# EAGLE design DUT_board (EAGLE 9.6.2)
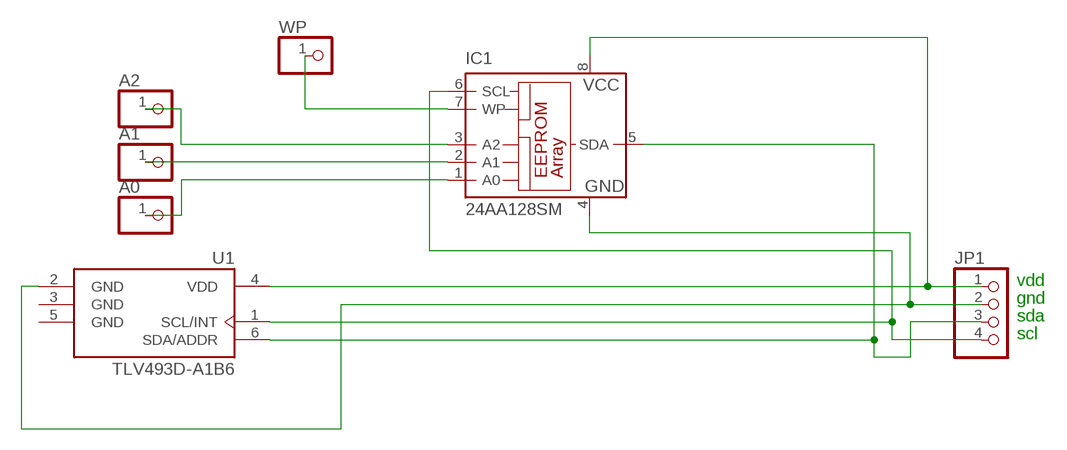
[diagram p0: schematic, sheet 1]

## Parts
A0  PINHD-1X1  [1X01]
A1  PINHD-1X1  [1X01]
A2  PINHD-1X1  [1X01]
IC1  24AA128SM  [SO-08M]
JP1  PINHD-1X4  [1X04]
U1  TLV493D-A1B6  [SOP95P250X110-6N-1-V1]
WP  PINHD-1X1  [1X01]

## Nets
N$1: IC1.8(VCC) JP1.1 U1.4(VDD)
N$2: IC1.4(GND) JP1.2 U1.2(GND)
N$3: IC1.6(SCL) JP1.4 U1.1(SCL/INT)
N$4: IC1.5(SDA) JP1.3 U1.6(SDA/ADDR)
N$5: A2.1 IC1.3(A2)
N$6: A1.1 IC1.2(A1)
N$7: A0.1 IC1.1(A0)
N$8: IC1.7(WP) WP.1

## Notes on the sheet
- vdd
- gnd
- sda
- scl

## Power pins joined to a net without a drawn wire
GND: U1.3(GND) U1.5(GND)

## Library data of the parts
A0 A1 A2 WP = pinhead:PINHD-1X1: PIN HEADER
IC1 = microchip:24*: Serial EEPROM I2C; MF: MICROCHIP; MPN: 24AA128-I/MS; OC_FARNELL: 1331285; OC_NEWARK: 92C6839
JP1 = pinhead:PINHD-1X4: PIN HEADER
U1 = TLV493D-A1B6:TLV493D-A1B6: TLV493D-A1B6 Low Power 3D Magnetic Sensor with I2C Interface SOP95P250X110-6N-1-V1

## Board
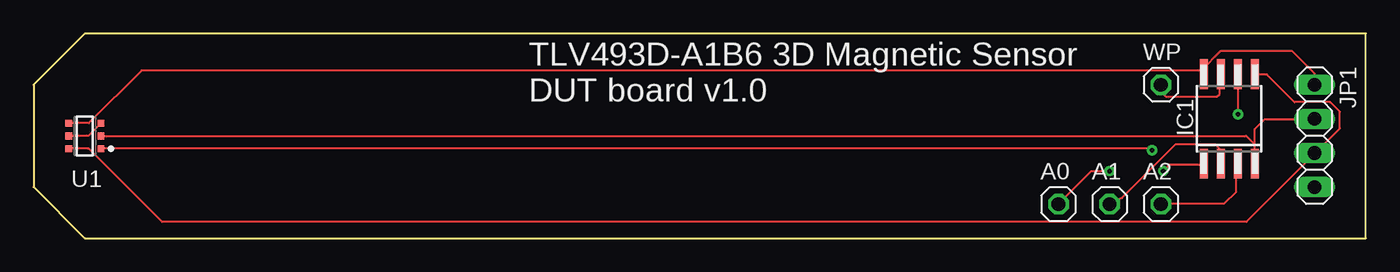
[diagram p1: board, top side]
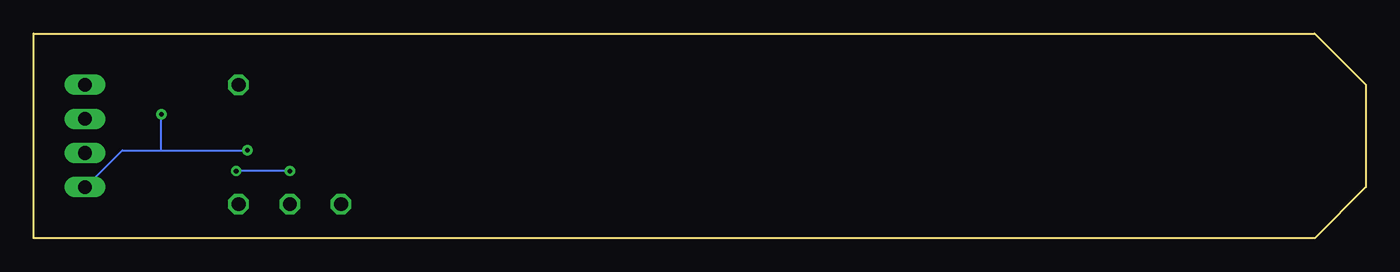
[diagram p2: board, bottom side, seen from below]

Size 99.06 x 15.24 mm. Coordinates in mm from the lower left corner, seen from the top.
Outline: 99.06,0 99.06,15.24 3.81,15.24 0,11.43 0,3.81 3.81,0 99.06,0
Copper layers (1*16): Top 0.035mm / dielectric 1.5mm / Bottom 0.035mm
Design rules "default": minimum track width 6mil, minimum drill 0.35mm, track to track 6mil, track to pad 6mil, pad to pad 6mil, via to via 6mil, smd to smd 6mil, copper to edge 40mil, drill to drill 6mil, minimum pad ring 10mil, minimum via ring 8mil, stop-mask expansion 4mil, vias tented up to drill 0mil, thermal gap 10mil

### Footprints (pad centres in the part's own frame; a part is rotated, then mirrored left to right if it is on the bottom)
1X01 = drill 1.016 octagon: 1 0,0
SO-08M = smd 0.6 x 2.2: 1 -1.905,-3.33; 2 -0.635,-3.33; 3 0.635,-3.33; 4 1.905,-3.33; 5 1.905,3.33; 6 0.635,3.33; 7 -0.635,3.33; 8 -1.905,3.33
1X04 = drill 1.016 long: 1 -3.81,0; 2 -1.27,0; 3 1.27,0; 4 3.81,0
SOP95P250X110-6N-1-V1 = smd 0.5 x 0.5: 1 -1.2,0.95; 2 -1.2,0; 3 -1.2,-0.95; 4 1.2,-0.95; 5 1.2,0; 6 1.2,0.95

### Placement (x,y rotation side)
A0  76.2,2.54 0 top
A1  80.01,2.54 0 top
A2  83.82,2.54 0 top
IC1  88.9,8.89 0 top
JP1  95.25,7.62 270 top
U1  3.81,7.62 180 top
WP  83.82,11.43 0 top

### Tracks (layer width: path | path; a pad name or v marks a point on that pad's centre or on a via)
GND
  Top 0.152: U1.5 4.06,7.62 4.98,8.53 U1.3
N$1
  Top 0.152: 86.82,12.5 8.03,12.5 4.11,8.58 U1.4 | 86.82,12.5 86.97,12.34 IC1.8 86.82,12.5 | JP1.1 95.25,12.24 93.54,13.96 88.28,13.96 86.82,12.5
N$2
  Top 0.152: U1.2 90.15,7.63 90.78,7 | IC1.4 90.78,5.64 90.78,7 | JP1.2 95.2,8.84 91.52,8.84 90.78,8.1 90.78,7
N$3  (via drill 0.35)
  Top 0.152: v83.16,6.55 83.04,6.67 U1.1 | U1.1 | v89.56,9.23 89.56,12.19 IC1.6
  Bottom 0.152: 89.56,6.55 92.46,6.55 95.2,3.81 JP1.4 | 89.56,6.55 v83.16,6.55 | 89.56,6.55 v89.56,9.23
N$4
  Top 0.152: U1.6 4.09,6.67 9.55,1.22 90.17,1.22 95.2,6.25 JP1.3 95.35,6.4 97.12,8.17 97.12,9.43 96.41,10.14 93.75,10.14 91.7,12.19 90.93,12.19 IC1.5
N$5
  Top 0.152: IC1.3 89.41,5.49 89.41,3.47 88.53,2.59 83.92,2.59 A2.1
N$6
  Top 0.152: IC1.2 88.19,5.64 88.19,6.66 87.84,7.01 84.93,7.01 80.92,2.99 A1.1
N$7  (via drill 0.35)
  Top 0.152: IC1.1 86.97,5.49 85,5.49 84.91,5.49 84.49,5.49 v84,5 | A0.1 78.66,5 v80,5
  Bottom 0.152: v80,5 v84,5
N$8
  Top 0.152: WP.1 83.82,10.91 84.18,10.55 87.99,10.55 88.19,10.74 88.19,12.19 IC1.7

### Text on the board
tNames: TLV493D-A1B6 3D Magnetic Sensor / DUT board v1.0